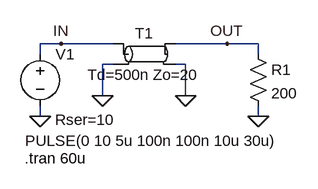
[diagram p0: schematic Fig_2-140_Transmission-Line.asc]
Fig_2-140_Transmission-Line.asc, the LTspice schematic file:
Version 4
SHEET 1 880 680
WIRE 96 112 64 112
WIRE 176 112 96 112
WIRE 352 112 272 112
WIRE 400 112 352 112
WIRE 64 128 64 112
WIRE 400 128 400 112
WIRE 176 144 160 144
WIRE 288 144 272 144
WIRE 160 192 160 144
WIRE 288 192 288 144
WIRE 64 224 64 208
WIRE 400 224 400 208
FLAG 64 224 0
FLAG 400 224 0
FLAG 160 192 0
FLAG 288 192 0
FLAG 352 112 OUT
FLAG 96 112 IN
SYMBOL voltage 64 112 R0
WINDOW 3 -23 149 Left 2
WINDOW 123 0 0 Left 2
WINDOW 39 23 117 Left 2
SYMATTR Value PULSE(0 10 5u 100n 100n 10u 30u)
SYMATTR SpiceLine Rser=10
SYMATTR InstName V1
SYMBOL tline 224 128 R0
SYMATTR InstName T1
SYMATTR Value Td=500n Zo=20
SYMBOL res 384 112 R0
SYMATTR InstName R1
SYMATTR Value 200
TEXT 40 288 Left 2 !.tran 60u

The netlist it stands for:
* Fig_2-140_Transmission-Line.asc
V1 IN 0 PULSE(0 10 5u 100n 100n 10u 30u) Rser=10
T1 IN 0 OUT 0 Td=500n Zo=20
R1 OUT 0 200
.tran 60u
.backanno
.end